# EAGLE design ADSR 7555 MAIN (EAGLE 7.7.0)
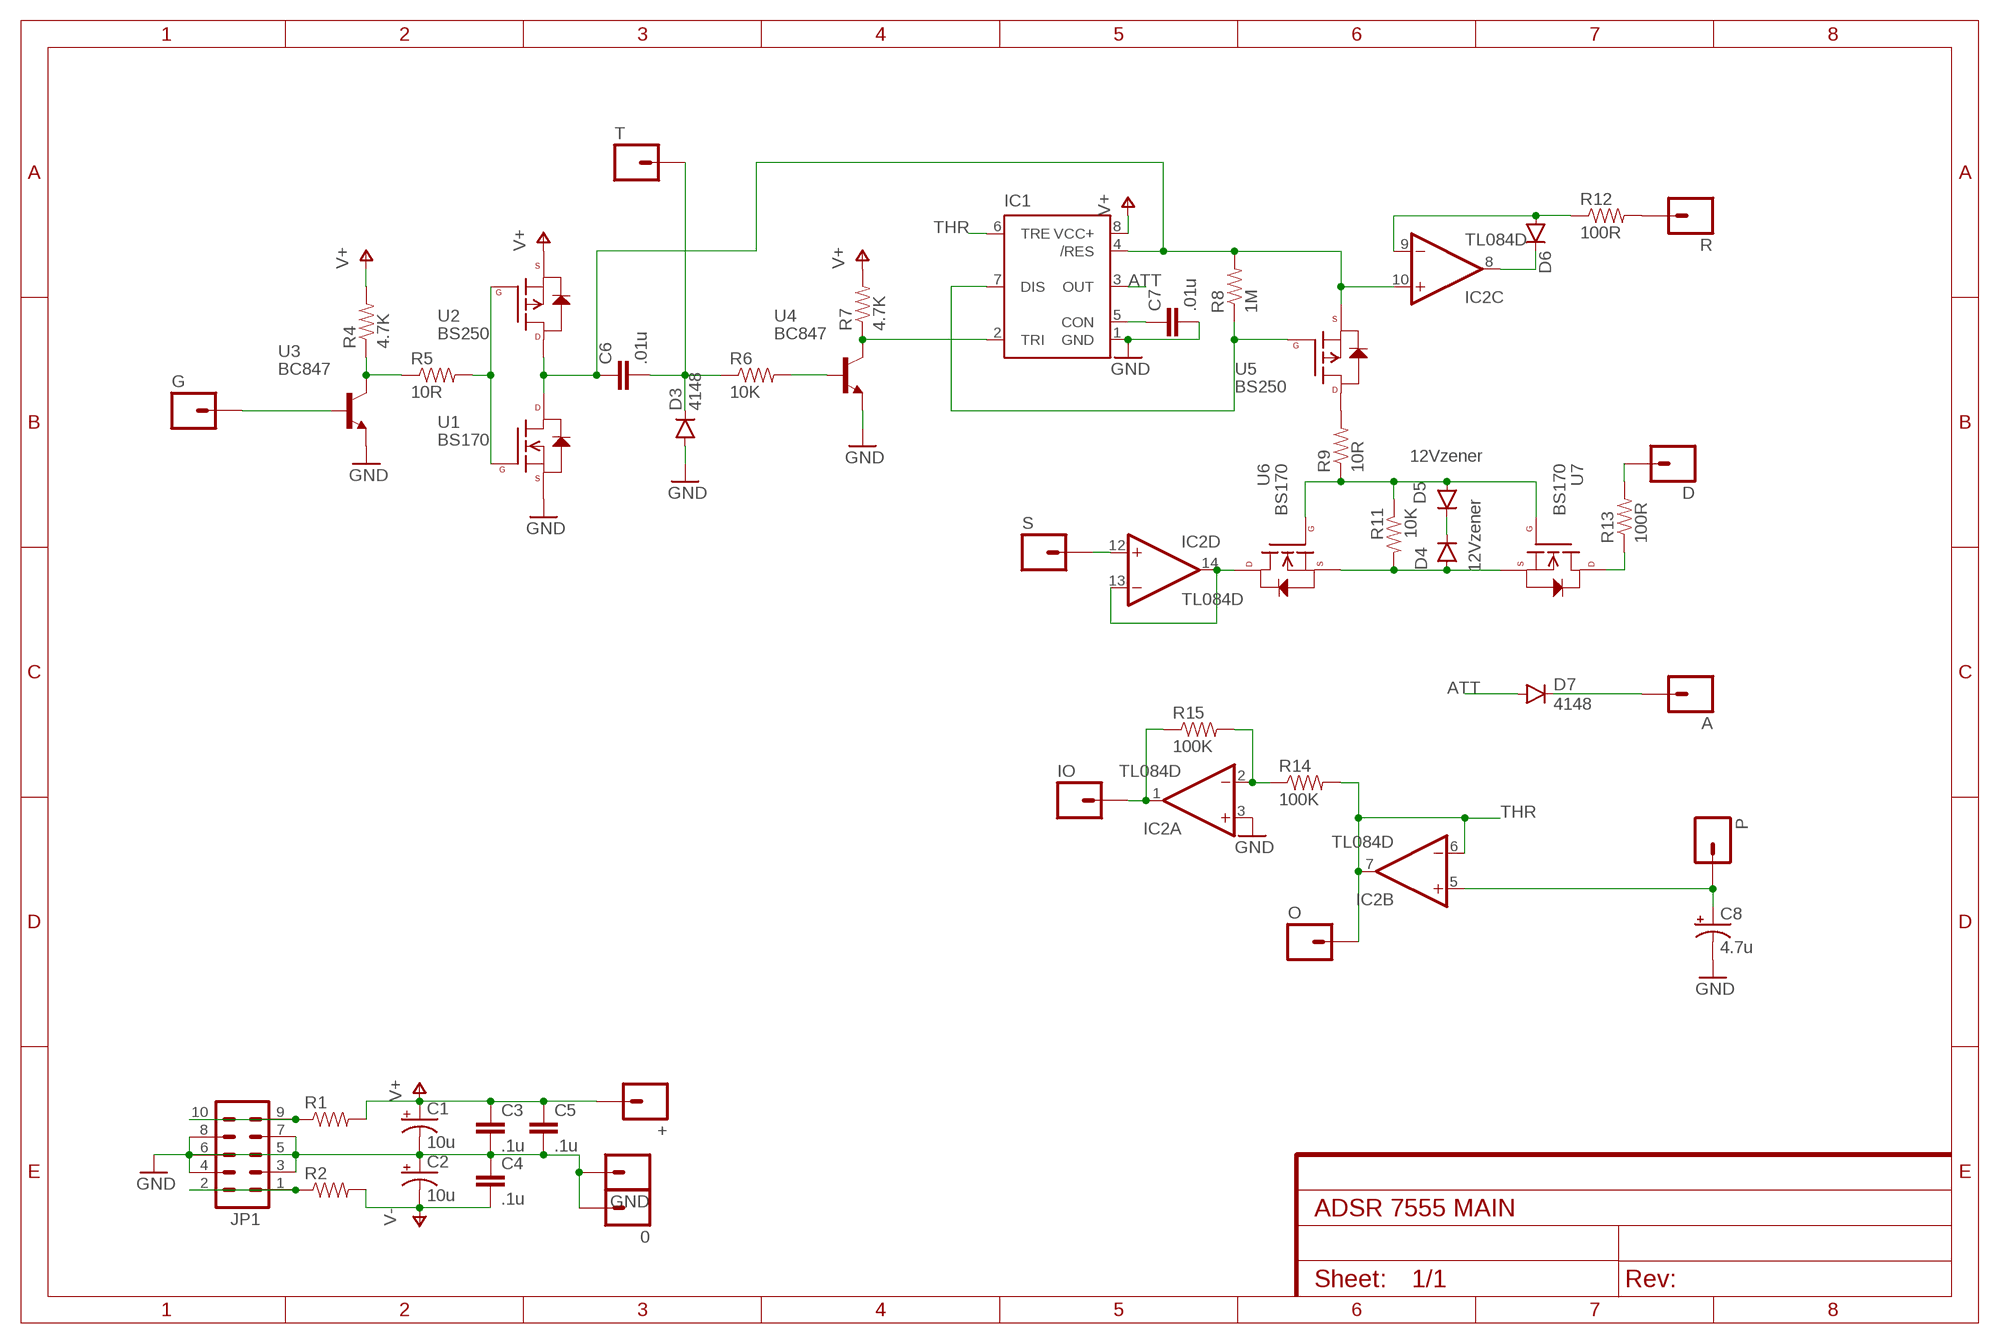
[diagram p0: schematic, sheet 1]

## Parts
0  M01PTH  [1X01]
+  M01PTH  [1X01]
A  M01PTH  [1X01]
C1  10u  CAP_POLPTH2  [CPOL-RADIAL-10UF-25V]
C2  10u  CAP_POLPTH2  [CPOL-RADIAL-10UF-25V]
C3  .1u  CAP0805  [0805]
C4  .1u  CAP0805  [0805]
C5  .1u  CAP0805  [0805]
C6  .01u  CAP0805  [0805]
C7  .01u  CAP0805  [0805]
C8  4.7u  CAP_POLPTH2  [CPOL-RADIAL-10UF-25V]
D  M01PTH  [1X01]
D3  4148  DIODESOD123  [SOD-123]
D4  12Vzener  DIODESOD123  [SOD-123]
D5  12Vzener  DIODESOD123  [SOD-123]
D6  DIODESOD123  [SOD-123]
D7  4148  DIODESOD123  [SOD-123]
G  M01PTH  [1X01]
GND  M01PTH  [1X01]
IC1  NE555D  [SO08]
IC2  TL084D  [SO14]
IO  M01PTH  [1X01]
JP1  M05X2PTH  [AVR_ICSP]
O  M01PTH  [1X01]
P  M01PTH  [1X01]
R  M01PTH  [1X01]
R1  RESISTOR0805-RES  [0805@1]
R2  RESISTOR0805-RES  [0805@1]
R4  4.7K  RESISTOR0805-RES  [0805@1]
R5  10R  RESISTOR0805-RES  [0805@1]
R6  10K  RESISTOR0805-RES  [0805@1]
R7  4.7K  RESISTOR0805-RES  [0805@1]
R8  1M  RESISTOR0805-RES  [0805@1]
R9  10R  RESISTOR0805-RES  [0805@1]
R11  10K  RESISTOR0805-RES  [0805@1]
R12  100R  RESISTOR0805-RES  [0805@1]
R13  100R  RESISTOR0805-RES  [0805@1]
R14  100K  RESISTOR0805-RES  [0805@1]
R15  100K  RESISTOR0805-RES  [0805@1]
S  M01PTH  [1X01]
T  M01PTH  [1X01]
U1  BS170  N-CHANNEL-MOSFET-BSS138  [SOT23-3]
U2  BS250  P-CHANNEL-MOSFET  [SOT23-3]
U3  BC847  [SOT23]
U4  BC847  [SOT23]
U5  BS250  P-CHANNEL-MOSFET  [SOT23-3]
U6  BS170  N-CHANNEL-MOSFET-BSS138  [SOT23-3]
U7  BS170  N-CHANNEL-MOSFET-BSS138  [SOT23-3]

## Nets
ATT: D7.A IC1.3(OUT)
GND: 0.1 C1.2(-) C2.1(+) C3.2 C4.1 C5.2 C7.2 C8.2(-) D3.A GND.1 IC1.1(GND) IC2.3(A:+IN) JP1.3 JP1.4 JP1.5 JP1.6 JP1.7 JP1.8 U1.2(S) U3.2(E) U4.2(E)
N$1: JP1.9 JP1.10 R1.1
N$2: JP1.1 JP1.2 R2.1
N$3: IC1.2(TRI) R7.1 U4.3(C)
N$4: G.1 U3.1(B)
N$5: C8.1(+) IC2.5(B:+IN) P.1
N$6: R4.1 R5.1 U3.3(C)
N$7: C7.1 IC1.5(CON)
N$8: R5.2 U1.1(G) U2.1(G)
N$9: C6.1 IC1.4(/RES) IC2.10(C:+IN) R8.2 U1.3(D) U2.3(D) U5.2(S)
N$10: C6.2 D3.C R6.1 T.1
N$11: R6.2 U4.1(B)
N$12: R12.2 R.1
N$14: IC1.7(DIS) R8.1 U5.1(G)
N$15: R9.2 U5.3(D)
N$16: D6.A IC2.9(C:-IN) R12.1
N$17: IC2.12(D:+IN) S.1
N$18: IC2.13(D:-IN) IC2.14(D:OUT) U6.3(D)
N$19: D4.A R11.2 U6.2(S) U7.2(S)
N$20: D4.C D5.C
N$21: D5.A R9.1 R11.1 U6.1(G) U7.1(G)
N$22: A.1 D7.C
N$23: D6.C IC2.8(C:OUT)
N$25: D.1 R13.2
N$26: R13.1 U7.3(D)
N$29: IC2.2(A:-IN) R14.1 R15.2
N$30: IC2.1(A:OUT) IO.1 R15.1
THR: IC1.6(TRE) IC2.6(B:-IN) IC2.7(B:OUT) O.1 R14.2
V+: +.1 C1.1(+) C3.1 C5.1 IC1.8(VCC+) R1.2 R4.2 R7.2 U2.2(S)
V-: C2.2(-) C4.2 R2.2

## Power pins joined to a net without a drawn wire
V+: IC2.4(P:V+)
V-: IC2.11(P:V-)

## Library data of the parts
0 + A D G GND IO O P R S T = SparkFun-Connectors:M01: Header 1 Standard 1-pin 0.1" header. Use with straight break away headers (SKU : PRT-00116), right angle break away headers (PRT-00553), swiss pins (PRT-00743), machine pins (PRT-00117), and female headers (PRT-00115).
C1 C2 C8 = SparkFun-Capacitors:CAP_POL: Capacitor Polarized These are standard SMD and PTH capacitors. Normally 10uF, 47uF, and 100uF in electrolytic and tantalum varieties. Always verify the external diameter of the through hole cap, it varies with capacity, voltage, and manufacturer. The EIA devices should be standard.
C3-C7 = SparkFun-Capacitors:CAP: Capacitor Standard 0603 ceramic capacitor, and 0.1" leaded capacitor.
D3-D7 = SparkFun-DiscreteSemi:DIODE: Diode These are standard reverse protection diodes and small signal diodes. SMA package can handle up to about 1A. SOD-323 can handle about 200mA. What the SOD-323 package when ordering, there are some mfgs out there that are 5-pin packages.
IC1 = SparkFun-AnalogIC:NE555: General purpose bipolar Timer
IC2 = linear:TL084: OP AMP
JP1 = SparkFun-Connectors:M05X2: Header 5x2 Standard 10-pin dual row 0.1" header. Commonly used with AVR-ISP. Use with Spark Fun Electronics SKU: PRT-00778
R1 R2 R4-R9 R11-R15 = SparkFun-Passives:RESISTOR: Resistor Basic schematic elements and footprints for 0603, 1206, and PTH resistors.
U1 U6 U7 = GeekAmmo:N-CHANNEL-MOSFET: N-Channel MOSFET Mode Field Effect Transistor; DATASHEET: http://www.fairchildsemi.com/ds/BS/BSS138.pdf; DIGIKEY: BSS138TR-ND; ELEMENT14: 2323154; URL: http://au.element14.com/fairchild-semiconductor/bss138/mosfet-n-ch-50v-220ma-sot-23/dp/2323154
U2 U5 = GeekAmmo:P-CHANNEL-MOSFET: P-Channel MOSFET Mode Field Effect Transistor
U3 U4 = transistor:BC847: NPN TRANSISTOR

## Board
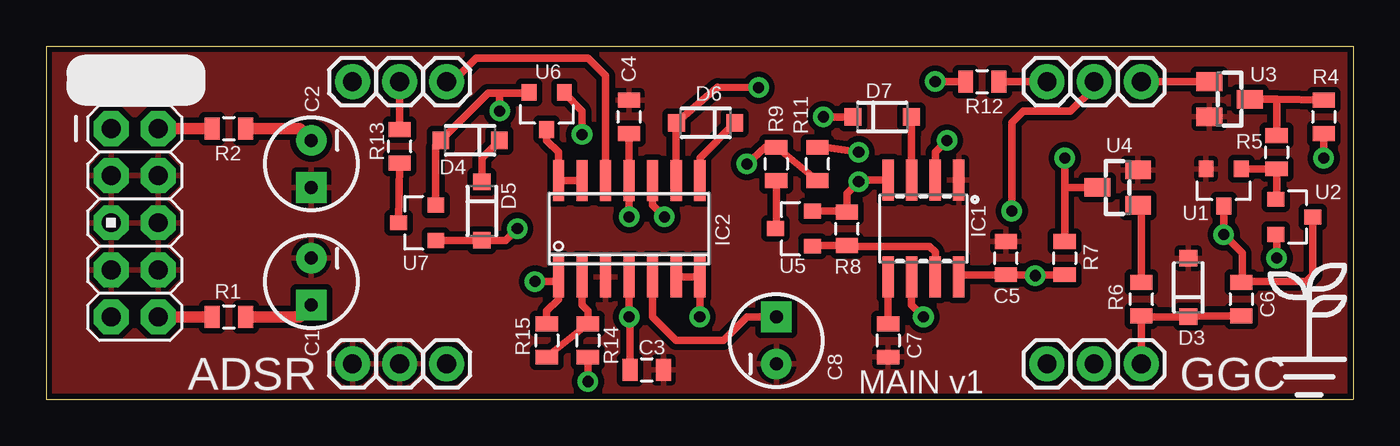
[diagram p1: board, top side]
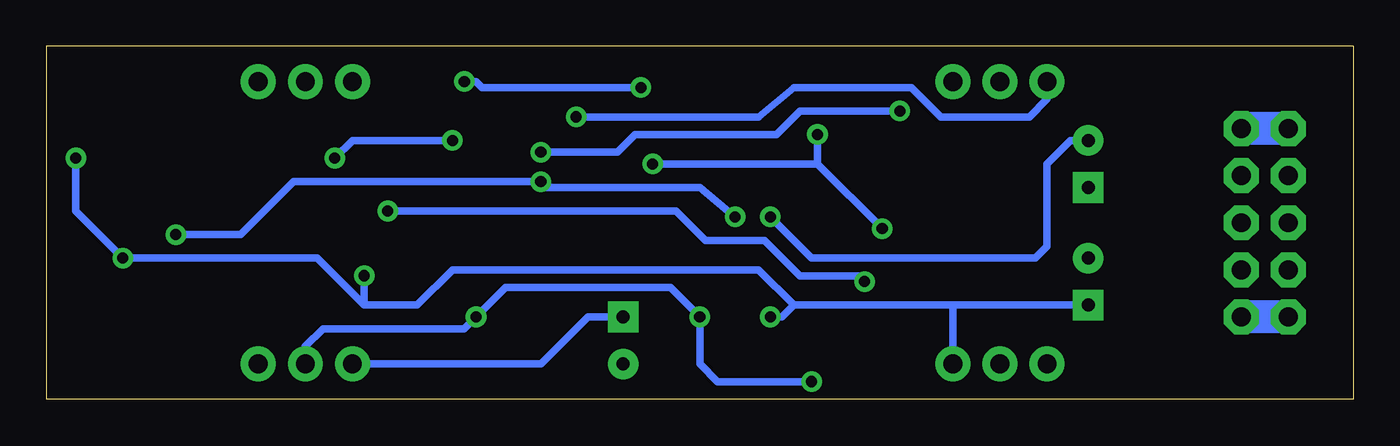
[diagram p2: board, bottom side, seen from below]

Size 70.48 x 19.05 mm. Coordinates in mm from the lower left corner, seen from the top.
Outline: 0,0 70.48,0 70.48,19.05 0,19.05 0,0
Copper layers (1*16): Top 0.035mm / dielectric 1.5mm / Bottom 0.035mm
Design rules "SparkFun": minimum track width 8mil, minimum drill 20mil, track to track 8mil, track to pad 8mil, pad to pad 8mil, via to via 8mil, smd to smd 8mil, copper to edge 8mil, drill to drill 8mil, minimum pad ring 12mil, minimum via ring 10mil, stop-mask expansion 4mil, vias tented up to drill 20mil, thermal gap 10mil

### Footprints (pad centres in the part's own frame; a part is rotated, then mirrored left to right if it is on the bottom)
1X01 = drill 1.016 pad 1.88: 1 0,0
CPOL-RADIAL-10UF-25V = drill 0.7 pad 1.651 square: 1 1.27,0 | drill 0.7 pad 1.651: 2 -1.27,0
0805 = smd 0.8 x 1.2: 1 -0.9,0; 2 0.9,0
SOD-123 = smd 0.9 x 0.95: A 1.575,0; C -1.575,0
SO08 = smd 0.61 x 2.21: 1 -1.905,-2.616; 2 -0.635,-2.616; 3 0.635,-2.616; 4 1.905,-2.616; 5 1.905,2.616; 6 0.635,2.616; 7 -0.635,2.616; 8 -1.905,2.616
SO14 = smd 0.6 x 2.2: 1 -3.81,-2.6; 2 -2.54,-2.6; 3 -1.27,-2.6; 4 0,-2.6; 5 1.27,-2.6; 6 2.54,-2.6; 7 3.81,-2.6; 8 3.81,2.6; 9 2.54,2.6; 10 1.27,2.6; 11 0,2.6; 12 -1.27,2.6; 13 -2.54,2.6; 14 -3.81,2.6
AVR_ICSP = drill 1.016 pad 1.88 octagon: 1 -1.27,5.08; 2 1.27,5.08; 3 -1.27,2.54; 4 1.27,2.54; 5 -1.27,0; 6 1.27,0; 7 -1.27,-2.54; 8 1.27,-2.54; 9 -1.27,-5.08; 10 1.27,-5.08
0805@1 = smd 0.8 x 1.2: 1 -0.9,0; 2 0.9,0
SOT23-3 = smd 0.8 x 0.9: 1 -0.95,-1; 2 0.95,-1; 3 0,1
SOT23 = smd 1 x 1.4: 1 -0.95,-1.1; 2 0.95,-1.1; 3 0,1.1

### Placement (x,y rotation side)
0  19.05,1.91 0 top
+  21.59,1.91 0 top
A  16.51,17.14 0 top
C1  14.29,6.35 270 top
C2  14.29,12.7 270 top
C3  32.38,1.59 0 top
C4  31.43,15.24 270 top
C5  51.75,7.62 90 top
C6  64.45,5.4 270 top
C7  45.4,3.17 270 top
C8  39.37,3.17 90 top
D  19.05,17.14 0 top
D3  61.59,6.03 90 top
D4  22.86,13.97 180 top
D5  23.5,10.16 270 top
D6  35.56,14.92 180 top
D7  45.09,15.24 0 top
G  59.05,17.14 0 top
GND  16.51,1.91 0 top
IC1  47.31,9.21 180 top
IC2  31.43,9.21 0 top
IO  56.52,17.14 0 top
JP1  4.76,9.53 0 top
O  56.52,1.91 0 top
P  53.98,1.91 0 top
R  53.98,17.14 0 top
R1  9.84,4.45 0 top
R2  9.84,14.61 0 top
R4  68.9,15.24 270 top
R5  66.36,13.34 270 top
R6  59.05,5.4 90 top
R7  54.93,7.62 270 top
R8  43.18,9.21 90 top
R9  39.37,12.7 270 top
R11  41.59,12.7 90 top
R12  50.48,17.14 0 top
R13  19.05,13.65 90 top
R14  29.21,3.17 270 top
R15  26.99,3.17 270 top
S  21.59,17.14 0 top
T  59.05,1.91 0 top
U1  63.5,11.43 180 top
U2  67.31,9.84 270 top
U3  63.82,16.19 270 top
U4  57.78,11.43 90 top
U5  40.32,9.21 90 top
U6  26.99,15.56 180 top
U7  20,9.53 90 top
U$1  [LOGO_SMALL]  68.1,2.22 0 top

### Tracks (layer width: path | path; a pad name or v marks a point on that pad's centre or on a via)
ATT
  Top 0.406: IC1.3 46.67,14.3 D7.A
GND
  pour Top (isolate 0.305): 0,0 70.48,0 70.48,19.05 0,19.05
N$1
  Top 0.61: R1.1 JP1.10
  Bottom 1.778: JP1.9 JP1.10
N$2
  Top 0.61: R2.1 JP1.2
  Bottom 1.778: JP1.1 JP1.2
N$3  (via drill 0.6)
  Top 0.406: R7.1 54.93,11.43 | U4.3 54.93,11.43 | 54.93,11.43 v54.93,13.02 | v48.58,13.97 47.94,13.34 IC1.2
  Bottom 0.406: v54.93,13.02 53.98,13.97 v48.58,13.97
N$4
  Top 0.406: G.1 U3.1
N$5
  Top 0.406: IC2.5 32.7,4.45 33.97,3.17 36.51,3.17 37.78,4.45 C8.1
  Bottom 0.406: P.1 43.81,1.91 41.27,4.45 C8.1
N$6
  Top 0.406: U3.3 66.36,16.19 | 66.36,16.19 R4.1 | R5.1 66.36,16.19
N$7
  Top 0.406: IC1.5 C7.1
N$8
  Top 0.406: U1.1 R5.2 | R5.2 | R5.2 66.36,10.84 U2.1
N$9  (via drill 0.6)
  Top 0.406: U2.3 68.31,6.71 67.94,6.35 64.5,6.35 | 64.5,6.35 C6.1 | U5.2 43.13,10.16 R8.2 43.18,11.11 v43.81,11.75 43.89,11.82 IC1.4 | v33.34,9.84 32.7,10.48 IC2.10 | 64.5,6.35 64.5,7.88 v63.5,8.89 U1.3
  Bottom 0.406: v33.34,9.84 35.24,11.43 43.5,11.43 v43.81,11.75 57.15,11.75 60.01,8.89 v63.5,8.89
N$10
  Top 0.406: C6.2 61.95,4.5 D3.C 59.09,4.46 R6.1 T.1
N$11
  Top 0.406: R6.2 59.05,9.99 U4.1
N$12
  Top 0.406: R12.2 R.1
N$14
  Top 0.406: IC1.7 47.94,7.94 47.62,8.26 43.23,8.26 R8.1 41.37,8.31 U5.1
N$15
  Top 0.406: R9.2 39.37,9.26 U5.3
N$16  (via drill 0.6)
  Top 0.406: IC2.9 D6.A 36.21,16.84 v38.42,16.83 | v47.94,17.14 R12.1
  Bottom 0.406: v38.42,16.83 46.99,16.83 47.31,17.14 v47.94,17.14
N$17
  Top 0.406: S.1 21.91,17.14 23.18,18.41 29.21,18.41 30.16,17.46 IC2.12
N$18
  Top 0.406: IC2.13 IC2.14 27.62,13.34 26.99,13.97 U6.3
N$19  (via drill 0.6)
  Top 0.406: U7.2 21,13.69 D4.A 21.29,13.98 23.81,16.51 24.45,16.51 | 24.45,16.51 25.99,16.51 U6.2 | R11.2 41.59,13.65 v43.81,13.34 | v24.45,15.56 24.45,16.51
  Bottom 0.406: v43.81,13.34 39.69,13.34 38.73,14.29 31.11,14.29 29.84,15.56 v24.45,15.56
N$20
  Top 0.406: D5.C 23.5,13.03 D4.C
N$21  (via drill 0.6)
  Top 0.406: U7.1 23.48,8.57 D5.A 23.51,8.57 24.77,8.57 v25.4,9.21 | U6.1 27.94,16.51 28.89,15.56 v28.89,14.29 | v37.78,12.7 38.79,13.6 R9.1 R11.1
  Bottom 0.406: v28.89,14.29 28.89,12.7 | 28.89,12.7 v25.4,9.21 | v37.78,12.7 28.89,12.7
N$22  (via drill 0.6)
  Top 0.406: v41.91,15.24 D7.C
  Bottom 0.406: A.1 16.51,16.19 17.46,15.24 22.23,15.24 23.81,16.83 30.16,16.83 32.07,15.24 v41.91,15.24
N$23
  Top 0.406: IC2.8 35.24,13.03 D6.C
N$25
  Top 0.406: D.1 R13.2
N$26
  Top 0.406: R13.1 U7.3
N$29
  Top 0.406: IC2.2 28.89,5.08 29.21,4.76 R14.1 R15.2
N$30  (via drill 0.6)
  Top 0.406: R15.1 26.99,4.76 27.62,5.4 IC2.1 27.36,6.35 v26.35,6.35 | IO.1 56.52,16.83 55.24,15.56 52.7,15.56 52.07,14.92 v52.07,10.16
  Bottom 0.406: v52.07,10.16 36.51,10.16 34.92,8.57 31.75,8.57 29.84,6.67 26.67,6.67 v26.35,6.35
THR  (via drill 0.6)
  Top 0.406: IC1.6 46.67,5.08 v47.31,4.45 | v35.24,4.45 IC2.7 IC2.6 | v29.21,0.95 R14.2
  Bottom 0.406: v29.21,0.95 34.29,0.95 35.24,1.91 v35.24,4.45 36.83,6.03 45.72,6.03 v47.31,4.45 47.94,3.81 55.56,3.81 56.52,2.86 O.1
V+  (via drill 0.6)
  Top 0.406: v66.36,7.62 66.36,8.85 U2.2 | R4.2 v68.9,13.02 | R7.2 53.39,6.72 v53.34,6.67 53.29,6.72 C5.1 49.34,6.72 IC1.8 | C3.1 31.48,4.39 v31.43,4.45 IC2.4
  Top 0.61: R1.2 13.65,4.45 C1.1
  Bottom 0.406: C1.1 21.59,5.08 | 21.59,5.08 30.16,5.08 | 30.16,5.08 32.07,6.99 48.58,6.99 50.48,5.08 53.34,5.08 | 53.34,5.08 55.88,7.62 v66.36,7.62 68.9,10.16 v68.9,13.02 | v53.34,6.67 53.34,5.08 | v31.43,4.45 30.8,4.45 30.16,5.08 | +.1 21.59,5.08
V-  (via drill 0.6)
  Top 0.406: v31.43,9.84 IC2.11 C4.2
  Top 0.61: R2.2 13.65,14.61 C2.2
  Bottom 0.406: C2.2 15.24,13.97 16.51,12.7 16.51,8.26 17.14,7.62 29.21,7.62 v31.43,9.84

### Text on the board
tPlace: ADSR | MAIN v1 | GGC